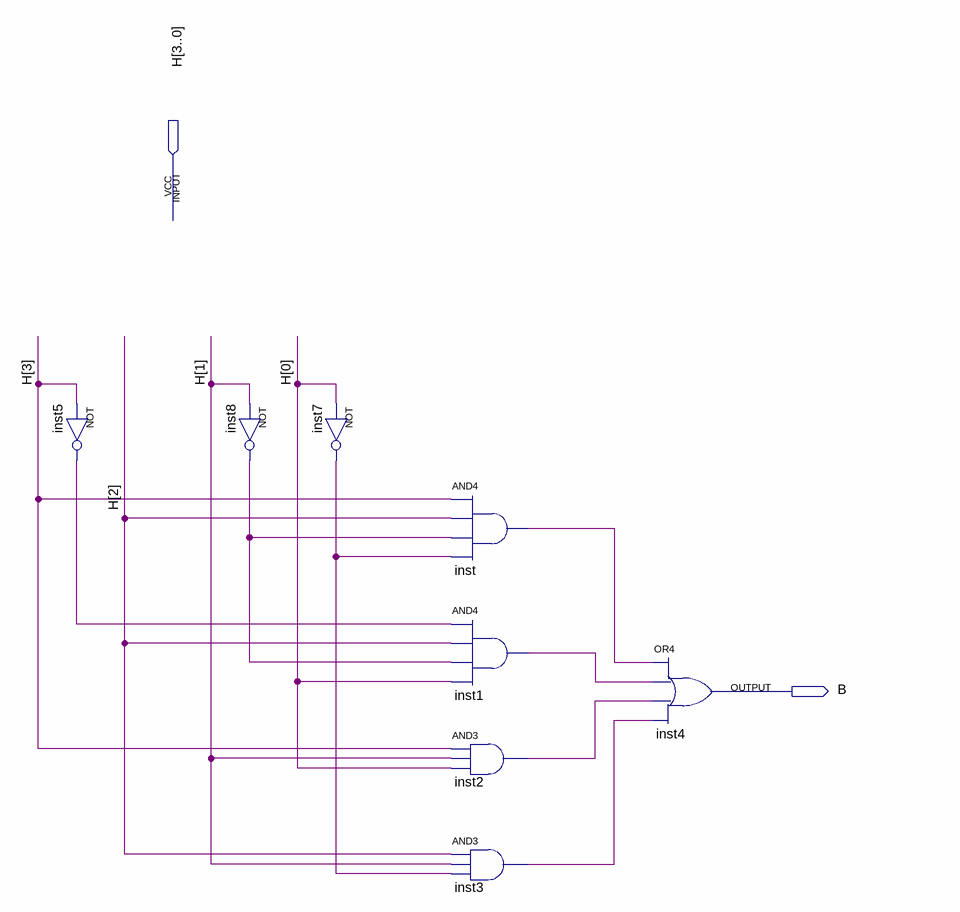
[diagram p0: schematic sheet]
// Quartus schematic B_Logic.bdf as structural Verilog: 8 symbols, 2 pins
module B_Logic (
  input  [3:0] H,
  output B
);

  wire inst1_out, inst2_out, inst3_out, inst5_out, inst7_out, inst8_out, inst_out;

  not inst5 (inst5_out, H[3]);
  not inst8 (inst8_out, H[1]);
  not inst7 (inst7_out, H[0]);
  and inst (inst_out, H[3], H[2], inst8_out, inst7_out);
  and inst1 (inst1_out, inst5_out, H[2], inst8_out, H[0]);
  and inst2 (inst2_out, H[3], H[1], H[0]);
  and inst3 (inst3_out, H[2], H[1], inst7_out);
  or inst4 (B, inst_out, inst1_out, inst2_out, inst3_out);
endmodule
